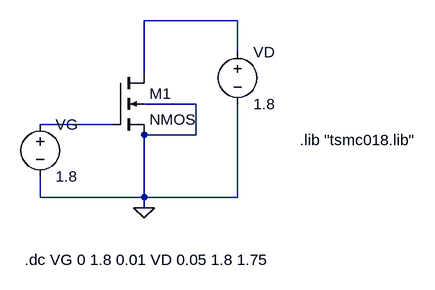
[diagram p0: schematic 180n_IDVG.asc]
180n_IDVG.asc, the LTspice schematic file:
Version 4
SHEET 1 880 680
WIRE 368 64 224 64
WIRE 368 112 368 64
WIRE 224 144 224 64
WIRE 304 192 224 192
WIRE 176 224 64 224
WIRE 304 240 304 192
WIRE 304 240 224 240
WIRE 64 336 64 304
WIRE 224 336 224 240
WIRE 224 336 64 336
WIRE 368 336 368 192
WIRE 368 336 224 336
WIRE 224 352 224 336
FLAG 224 352 0
SYMBOL nmos4 176 144 R0
SYMATTR InstName M1
SYMATTR Value2 l=180n w=270n
SYMBOL voltage 64 208 R0
SYMATTR InstName VG
SYMATTR Value 1.8
SYMBOL voltage 368 96 R0
WINDOW 123 0 0 Left 0
WINDOW 39 0 0 Left 0
SYMATTR InstName VD
SYMATTR Value 1.8
TEXT 464 248 Left 2 !.lib "tsmc018.lib"
TEXT 40 432 Left 2 !.dc VG 0 1.8 0.01 VD 0.05 1.8 1.75

The netlist it stands for:
* 180n_IDVG.asc
M1 N001 N002 0 0 NMOS l=180n w=270n
VG N002 0 1.8
VD N001 0 1.8
.model NMOS NMOS
.model PMOS PMOS
.lib standard.mos
.lib "tsmc018.lib"
.dc VG 0 1.8 0.01 VD 0.05 1.8 1.75
.backanno
.end